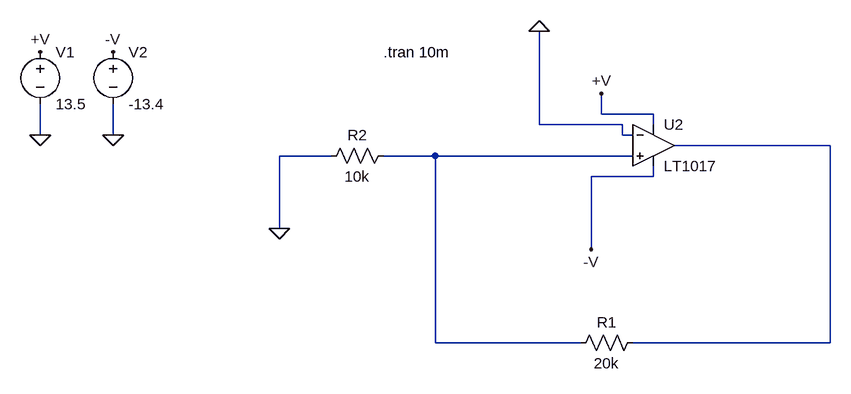
[diagram p0: schematic Draft1.asc]
Draft1.asc, the LTspice schematic file:
Version 4
SHEET 1 1092 680
WIRE 736 224 736 192
WIRE 816 224 736 224
WIRE 640 240 640 96
WIRE 768 240 640 240
WIRE 816 240 816 224
WIRE -128 256 -128 208
WIRE -16 256 -16 208
WIRE 768 256 768 240
WIRE 784 256 768 256
WIRE 1088 272 848 272
WIRE 320 288 240 288
WIRE 480 288 400 288
WIRE 784 288 480 288
WIRE 816 320 816 304
WIRE 816 320 720 320
WIRE 240 400 240 288
WIRE 720 432 720 320
WIRE 480 576 480 288
WIRE 704 576 480 576
WIRE 1088 576 1088 272
WIRE 1088 576 784 576
FLAG 736 192 +V
FLAG 720 432 -V
FLAG -128 256 0
FLAG -16 256 0
FLAG -128 128 +V
FLAG -16 128 -V
FLAG 240 400 0
FLAG 640 96 0
SYMBOL LT1017 816 272 R0
SYMATTR InstName U2
SYMBOL voltage -128 112 R0
WINDOW 123 0 0 Left 2
WINDOW 39 0 0 Left 2
SYMATTR InstName V1
SYMATTR Value 13.5
SYMBOL voltage -16 112 R0
WINDOW 123 0 0 Left 2
WINDOW 39 0 0 Left 2
SYMATTR InstName V2
SYMATTR Value -13.4
SYMBOL res 800 560 R90
WINDOW 0 0 56 VBottom 2
WINDOW 3 32 56 VTop 2
SYMATTR InstName R1
SYMATTR Value 20k
SYMBOL res 416 272 R90
WINDOW 0 0 56 VBottom 2
WINDOW 3 32 56 VTop 2
SYMATTR InstName R2
SYMATTR Value 10k
TEXT 400 128 Left 2 !.tran 10m

The netlist it stands for:
* Draft1.asc
XU2 N002 0 +V -V N001 LT1017  ; pins In+ In- V+ V- OUT
V1 +V 0 13.5
V2 -V 0 -13.4
R1 N001 N002 20k
R2 N002 0 10k
.tran 10m
.backanno
.end